# EAGLE design TPL5111_breakout (EAGLE 7.7.0)
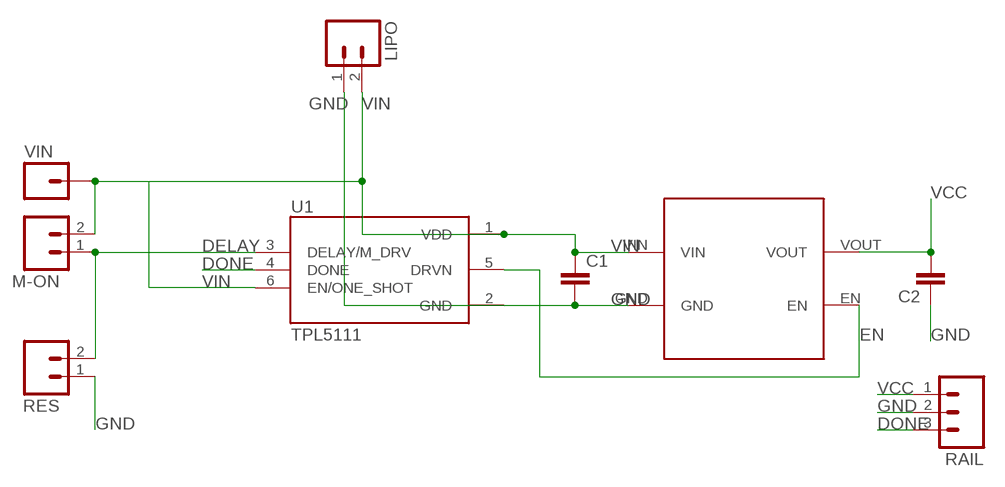
[diagram p0: schematic, sheet 1]

## Parts
C1  CAP0603-CAP  [0603-CAP]
C2  CAP0603-CAP  [0603-CAP]
LIPO  M02PTH  [1X02]
M-ON  M02PTH  [1X02]
RAIL  M03PTH  [1X03]
RES  M02PTH  [1X02]
U1  TPL5111  TPL5111DDCR  [SOT95P280X110-6N]
U$2  AP2112K  [AP2112K-SOT23-5]
VIN  M01PTH  [1X01]

## Nets
DELAY: M-ON.1 RES.2 U1.3(DELAY/M_DRV)
DONE: RAIL.3 U1.4(DONE)
EN: U1.5(DRVN) U$2.EN
GND: C1.2 C2.1 LIPO.1 RAIL.2 RES.1 U1.2(GND) U$2.GND
VCC: C2.2 RAIL.1 U$2.VOUT
VIN: C1.1 LIPO.2 M-ON.2 U1.1(VDD) U1.6(EN/ONE_SHOT) U$2.VIN VIN.1

## Library data of the parts
C1 C2 = SparkFun-Passives:CAP: Capacitor Standard 0603 ceramic capacitor, and 0.1" leaded capacitor.
LIPO M-ON RES = SparkFun-Connectors:M02: Standard 2-pin 0.1" header. Use with - straight break away headers ( PRT-00116) - right angle break away headers (PRT-00553) - swiss pins (PRT-00743) - machine pins (PRT-00117) - female headers (PRT-00115) Molex polarized connector foot print use with: PRT-08233 with associated crimp pins and housings. 2.54_SCREWTERM for use with PRT-10571. 3.5mm Screw Terminal footprints for PRT-08084 5mm Screw Terminal footprints for use with PRT-08432
RAIL = SparkFun-Connectors:M03: Header 3 Standard 3-pin 0.1" header. Use with straight break away headers (SKU : PRT-00116), right angle break away headers (PRT-00553), swiss pins (PRT-00743), machine pins (PRT-00117), and female headers (PRT-00115). Molex polarized connector foot print use with SKU : PRT-08232 with associated crimp pins and housings.
U1 = TPL5111DDCR:TPL5111DDCR: Ultra Low Power System Timer (35 nA) for Power Gating in duty cycled applications 6-SOT -40 to 105; AVAILABILITY: Good; DESCRIPTION: Ultra Low Power System Timer (35 nA) for Power Gating in duty cycled applications 6-SOT -40 to 105; MF: Texas Instruments; MP: TPL5111DDCR; PACKAGE: None; PRICE: 0.46 USD
U$2 = TPL5111DDCR:AP2112K
VIN = SparkFun-Connectors:M01: Header 1 Standard 1-pin 0.1" header. Use with straight break away headers (SKU : PRT-00116), right angle break away headers (PRT-00553), swiss pins (PRT-00743), machine pins (PRT-00117), and female headers (PRT-00115).

## Board
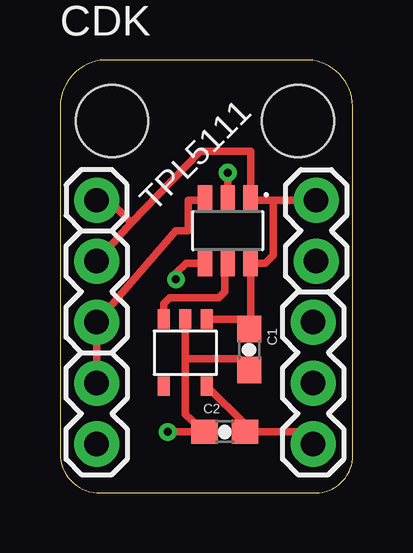
[diagram p1: board, top side]
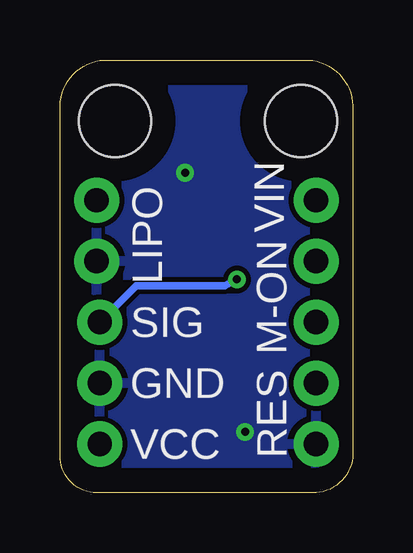
[diagram p2: board, bottom side, seen from below]

Size 12.2 x 18.04 mm. Coordinates in mm from the lower left corner, seen from the top.
Outline: 10.36,18.04 1.84,18.04 arc90 0,15.95 0,1.78 arc90 1.53,0.01 10.52,0.01 arc90 12.2,1.43 12.2,15.95 arc90 10.36,18.04
Copper layers (1*16): Top 0.035mm / dielectric 1.5mm / Bottom 0.035mm
Design rules "default *": minimum track width 10mil, minimum drill 24mil, track to track 8mil, track to pad 8mil, pad to pad 8mil, via to via 8mil, smd to smd 8mil, copper to edge 40mil, drill to drill 8mil, minimum pad ring 10mil, minimum via ring 8mil, stop-mask expansion 4mil, vias tented up to drill 13mil, thermal gap 10mil
Holes 3 mm at 9.91,15.5 2.16,15.5

### Footprints (pad centres in the part's own frame; a part is rotated, then mirrored left to right if it is on the bottom)
0603-CAP = smd 1.1 x 1: 1 -0.85,0; 2 0.85,0
1X02 = drill 1.016 pad 1.88: 1 0,0; 2 2.54,0
1X03 = drill 1.016 pad 1.88: 1 0,0; 2 2.54,0; 3 5.08,0
SOT95P280X110-6N = smd 1.1 x 0.6: 1 -1.35,0.95; 2 -1.35,0; 3 -1.35,-0.95; 4 1.35,-0.95; 5 1.35,0; 6 1.35,0.95
AP2112K-SOT23-5 = smd 0.8 x 0.5: EN 0,0; GND 0,0.9; NC 2.8,0; VIN 0,1.8; VOUT 2.8,1.8
1X01 = drill 1.016 pad 1.88: 1 0,0

### Placement (x,y rotation side)
C1  7.88,5.97 270 top
C2  6.86,2.55 0 top
LIPO  10.67,9.66 90 top
M-ON  1.53,7.12 90 top
RAIL  10.55,2.04 90 top
RES  1.53,2.04 90 top
U1  6.99,10.93 270 top
U$2  4.32,7.24 270 top
VIN  1.53,12.2 0 top

### Tracks (layer width: path | path; a pad name or v marks a point on that pad's centre or on a via)
DELAY
  Top 0.305: U1.3 5.96,12.2 5.34,12.2 5.34,10.93 4.83,10.93 M-ON.1 RES.2
DONE  (via drill 0.33)
  Top 0.305: U1.4 5.26,9.58 4.83,9.15 v4.83,8.9
  Bottom 0.305: v4.83,8.9 5.34,8.64 9.02,8.64 RAIL.3
EN
  Top 0.305: U$2.EN 4.32,7.88 4.58,8.13 6.61,8.13 6.86,8.39 6.86,9.45 U1.5
GND  (via drill 0.33)
  Top 0.305: U1.2 v6.99,13.34 | U$2.GND 5.22,5.59 | 5.22,5.59 5.22,3.28 C2.1 v4.49,2.55 | C1.2 7.47,5.59 5.22,5.59
  pour Bottom: -15.36,23.12 15.12,23.12 15.12,-14.35 -15.36,-14.35
VCC
  Top 0.305: RAIL.1 10.04,2.55 C2.2 7.73,2.87 U$2.VOUT
VIN
  Top 0.305: LIPO.2 8.89,12.2 | 8.89,12.2 8.02,12.2 U1.1 7.94,14.23 5.85,14.23 2.97,11.26 | 2.97,11.26 M-ON.2 | 8.89,12.2 8.89,9.91 8.56,9.58 U1.6 7.94,6.89 C1.1 7.46,7.24 U$2.VIN | VIN.1 2.03,12.2 2.97,11.26

### Text on the board
tNames: WeatherCube / Power Mgmt & Gating / v1.0 2017-02-05 / CDK
bNames: SIG | GND | VCC